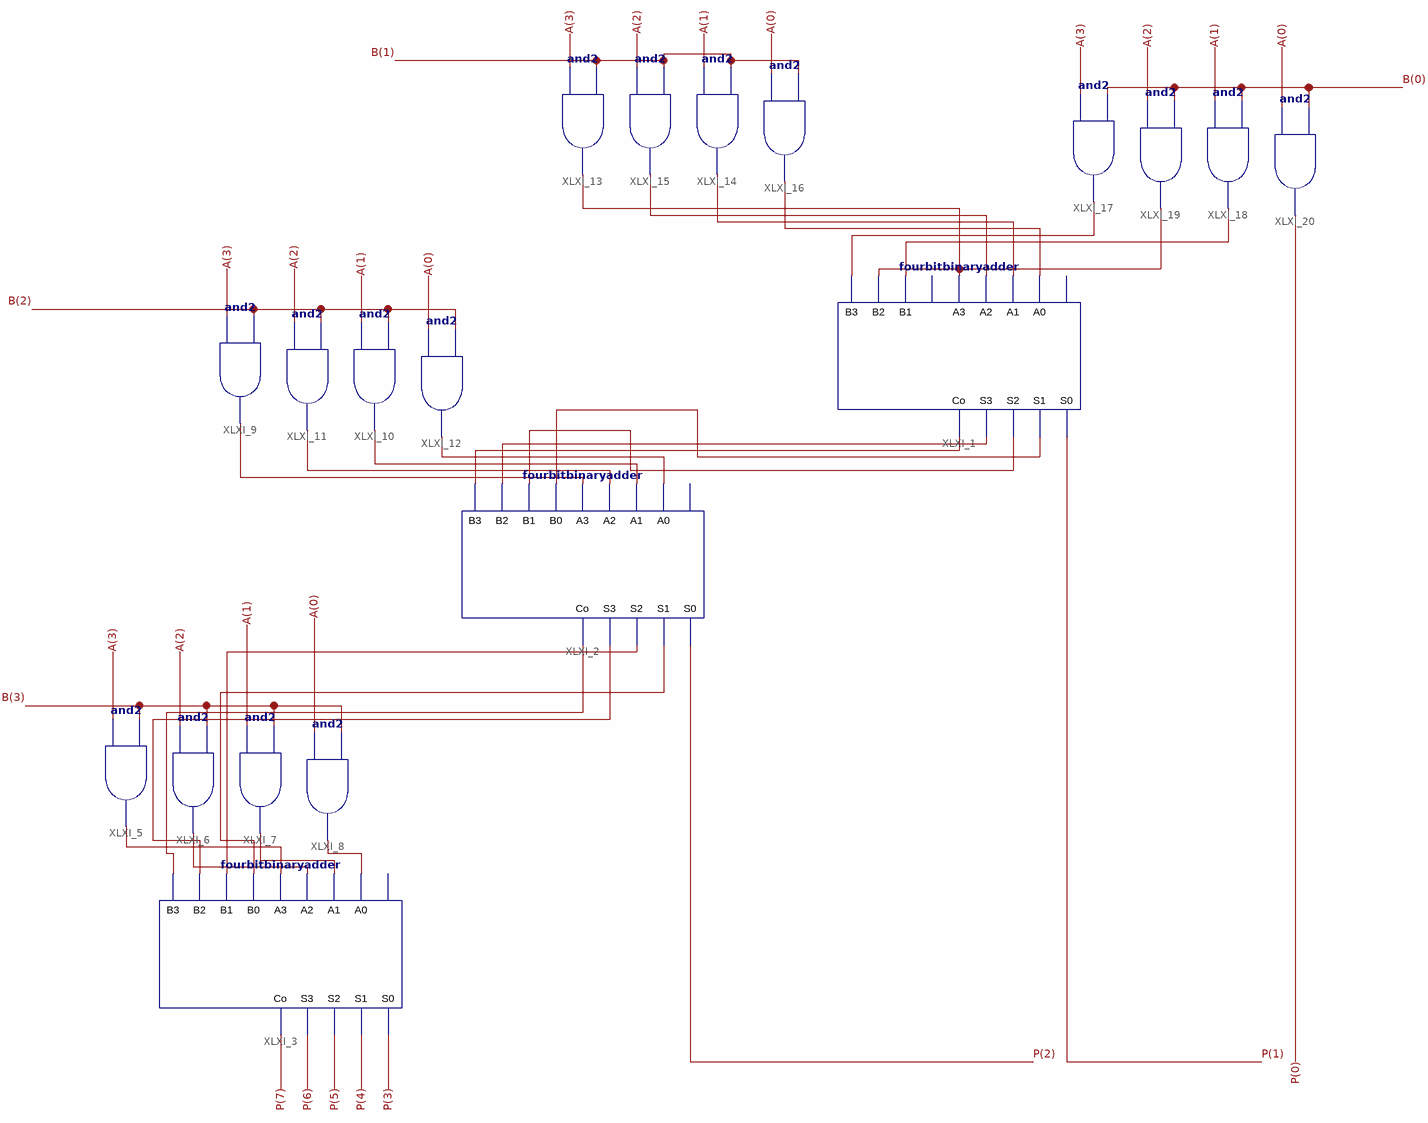
[diagram p0: schematic sheet 1]
// Xilinx ISE schematic Multiplier4x4.sch (artix7) as structural Verilog: 19 symbols, 0 ports
module Multiplier4x4 (
);

  wire XLXN_1, XLXN_3, XLXN_9, XLXN_10, XLXN_11, XLXN_12, XLXN_14, XLXN_15, XLXN_16, XLXN_17, XLXN_18,
       XLXN_19, XLXN_20, XLXN_21, XLXN_23, XLXN_24, XLXN_25, XLXN_26, XLXN_27, XLXN_28, XLXN_29, XLXN_30,
       XLXN_46;
  wire [3:0] A, B;
  wire [7:0] P;

  fourbitbinaryadder XLXI_1 (
    .A0(XLXN_9), .A1(XLXN_10), .B1(XLXN_1), .B2(XLXN_46), .A2(XLXN_11), .A3(XLXN_12), .B3(XLXN_3),
    .Co(XLXN_18), .S2(XLXN_20), .S1(XLXN_21), .S3(XLXN_19), .S0(P[1]));  // open: B0, Cin
  fourbitbinaryadder XLXI_2 (
    .A0(XLXN_14), .B0(XLXN_21), .A1(XLXN_15), .B1(XLXN_20), .B2(XLXN_19), .A2(XLXN_16), .A3(XLXN_17),
    .B3(XLXN_18), .Co(XLXN_30), .S2(XLXN_28), .S1(XLXN_27), .S3(XLXN_29), .S0(P[2]));  // open: Cin
  fourbitbinaryadder XLXI_3 (
    .A0(XLXN_23), .B0(XLXN_27), .A1(XLXN_24), .B1(XLXN_28), .B2(XLXN_29), .A2(XLXN_25), .A3(XLXN_26),
    .B3(XLXN_30), .Co(P[7]), .S2(P[5]), .S1(P[4]), .S3(P[6]), .S0(P[3]));  // open: Cin
  and XLXI_5 (XLXN_26, A[3], B[3]);
  and XLXI_6 (XLXN_25, A[2], B[3]);
  and XLXI_7 (XLXN_24, A[1], B[3]);
  and XLXI_8 (XLXN_23, A[0], B[3]);
  and XLXI_17 (XLXN_3, A[3], B[0]);
  and XLXI_18 (XLXN_1, A[1], B[0]);
  and XLXI_19 (XLXN_46, A[2], B[0]);
  and XLXI_20 (P[0], A[0], B[0]);
  and XLXI_13 (XLXN_46, A[3], B[1]);
  and XLXI_14 (XLXN_10, A[1], B[1]);
  and XLXI_15 (XLXN_11, A[2], B[1]);
  and XLXI_16 (XLXN_9, A[0], B[1]);
  and XLXI_9 (XLXN_17, A[3], B[2]);
  and XLXI_10 (XLXN_15, A[1], B[2]);
  and XLXI_11 (XLXN_16, A[2], B[2]);
  and XLXI_12 (XLXN_14, A[0], B[2]);
endmodule
